# Altium schematic sheet GSB-S03-CarMicrofit.SchDoc
size A4
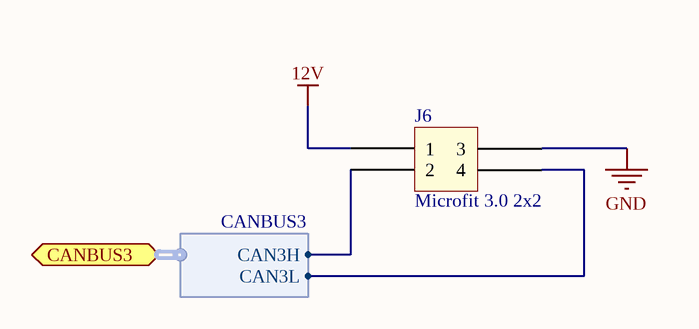
[diagram p0: GSB-S03-CarMicrofit.SchDoc]

## Parts
J6  Microfit 3.0 2x2  [Microfit_2X2_R_TH]

## Ports
CANBUS3 (bidir, harness CANBUS3)

## Harnesses
CANBUS3: CAN3H, CAN3L

## Nets
12V: J6.1
GND: J6.3
NetJ6_2: J6.2 ; port CANBUS3.CAN3H
NetJ6_4: J6.4 ; port CANBUS3.CAN3L

## Library data of the parts
J6 = Microfit_2x2